# EasyEDA Pro project voice-light.eprj

# Schematic Schematic1
Board Name: Board1; Create Date: 2025-03-19; Page Name: P1; Project Name: voice-light; Schematic Name: Schematic1; Update Date: 2025-03-21; Company: 嘉立创EDA; Page Size: A4; Version: V1.0
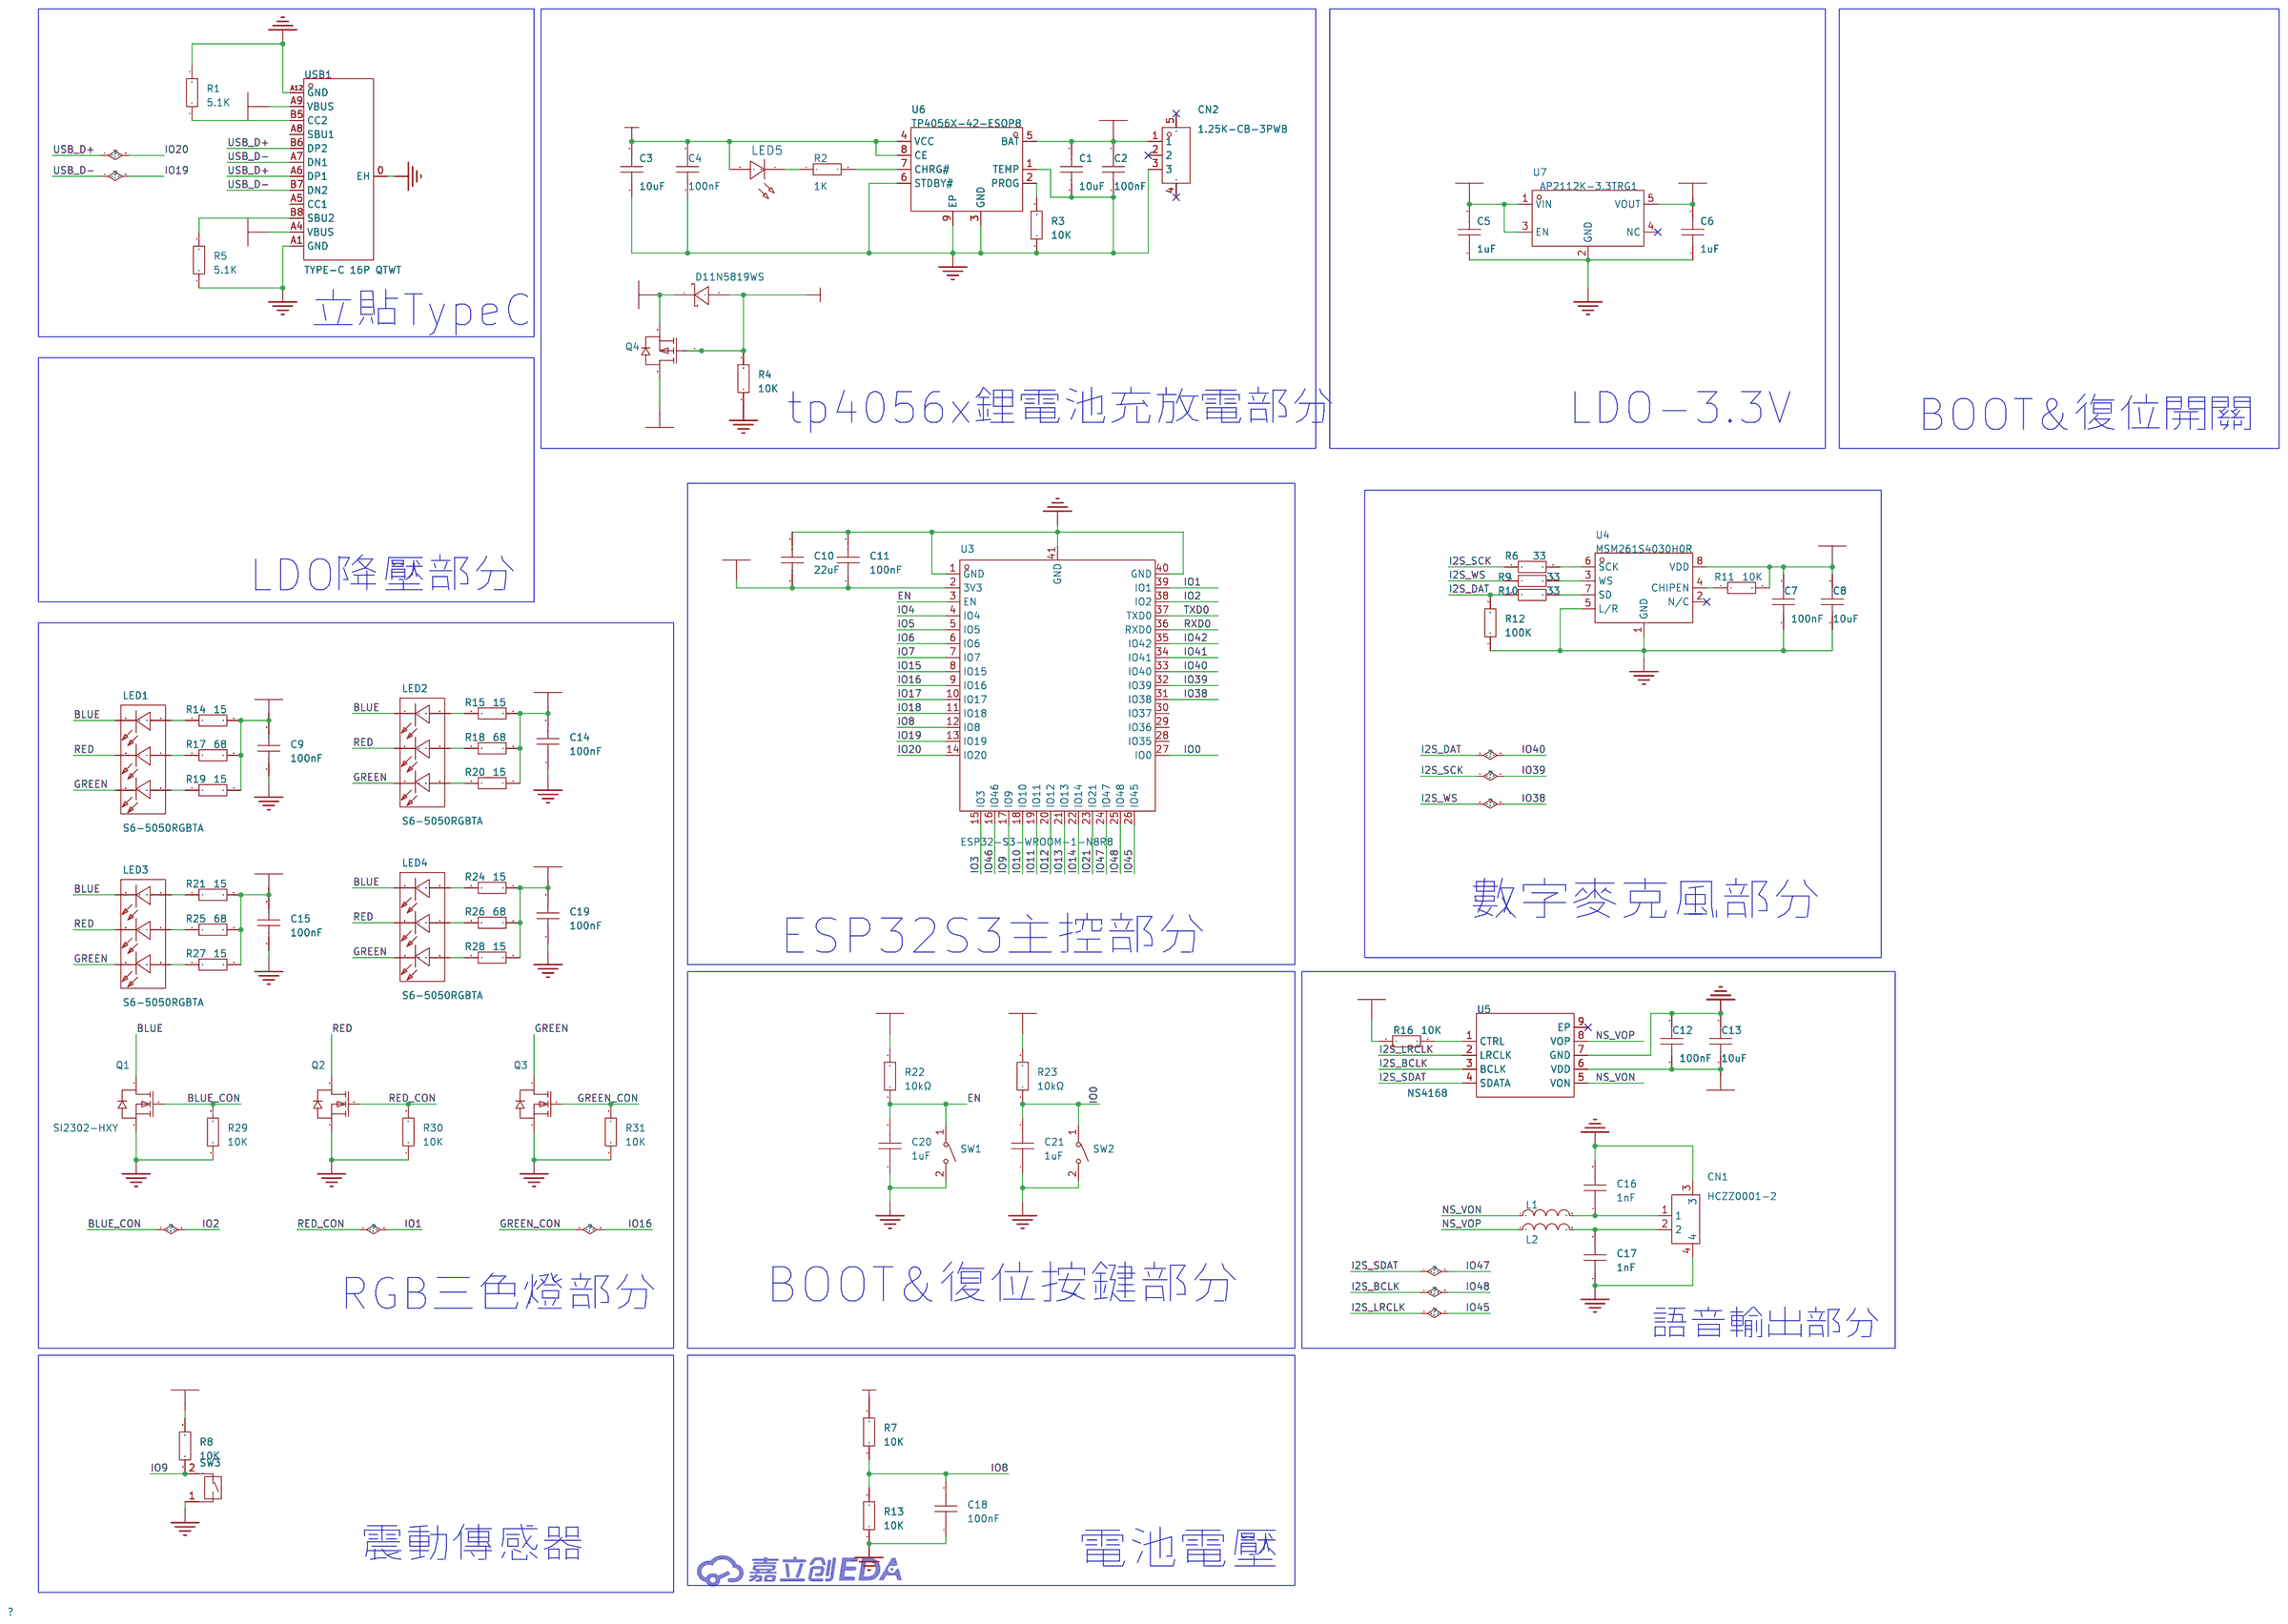
[diagram p0: schematic sheet]

## Parts
C1  10uF  [C0603]
C2  100nF  [C0603]
C3  10uF  [C0603]
C4  100nF  [C0603]
C5  1uF  [C0603]
C6  1uF  [C0603]
C7  100nF  [C0603]
C8  10uF  [C0603]
C9  100nF  [C0603]
C10  22uF  [C0603]
C11  100nF  [C0603]
C12  100nF  [C0603]
C13  10uF  [C0603]
C14  100nF  [C0603]
C15  100nF  [C0603]
C16  1nF  [C0603]
C17  1nF  [C0603]
C18  100nF  [C0603]
C19  100nF  [C0603]
C20  1uF  [C0603]
C21  1uF  [C0603]
CN1  HCZZ0001-2  [CONN-SMD_2P-P1.25_HC_HCZZ0001-2]
CN2  1.25K-CB-3PWB  [CONN-SMD_3P-P1.25_L5.5-W8.9-3PWB]
D1  1N5819WS  [SOD-323_L1.8-W1.3-LS2.5-RD]
L1  BLM18AG102SN1D  [L0603]
L2  BLM18AG102SN1D  [L0603]
LED1  S6-5050RGBTA  [LED-SMD_6P-L5.0-W5.0-P1.60-LS5.4-TL]
LED2  S6-5050RGBTA  [LED-SMD_6P-L5.0-W5.0-P1.60-LS5.4-TL]
LED3  S6-5050RGBTA  [LED-SMD_6P-L5.0-W5.0-P1.60-LS5.4-TL]
LED4  S6-5050RGBTA  [LED-SMD_6P-L5.0-W5.0-P1.60-LS5.4-TL]
LED5  -  [LED_0603]
Q1  SI2302-HXY  [SOT-23-3_L2.9-W1.3-P1.90-LS2.4-BR]
Q2  SI2302-HXY  [SOT-23-3_L2.9-W1.3-P1.90-LS2.4-BR]
Q3  SI2302-HXY  [SOT-23-3_L2.9-W1.3-P1.90-LS2.4-BR]
Q4  AO3401A  [SOT-23_L2.9-W1.3-P1.90-LS2.4-BR]
R1  5.1K  [R0603]
R2  1K  [R0603]
R3  10K  [R0603]
R4  10K  [R0603]
R5  5.1K  [R0603]
R6  33  [R0603]
R7  10K  [R0603]
R8  10K  [R0603]
R9  33  [R0603]
R10  33  [R0603]
R11  10K  [R0603]
R12  100K  [R0603]
R13  10K  [R0603]
R14  15  [R0603]
R15  15  [R0603]
R16  10K  [R0603]
R17  68  [R0603]
R18  68  [R0603]
R19  15  [R0603]
R20  15  [R0603]
R21  15  [R0603]
R22  10kΩ  [R0603]
R23  10kΩ  [R0603]
R24  15  [R0603]
R25  68  [R0603]
R26  68  [R0603]
R27  15  [R0603]
R28  15  [R0603]
R29  10K  [R0603]
R30  10K  [R0603]
R31  10K  [R0603]
SW1  TS-1088R-02026  [SW-SMD_L3.9-W3.0-P4.45]
SW2  TS-1088R-02026  [SW-SMD_L3.9-W3.0-P4.45]
SW3  SW-18010P  [SW-TH_SW-18010P]
U3  ESP32-S3-WROOM-1-N8R8  [WIRELM-SMD_ESP32-S3-WROOM-1]
U4  MSM261S4030H0R  [MIC-SMD_8P-L4.0-W3.0-P1.00-BR]
U5  NS4168  [ESOP-8_L4.9-W3.9-P1.27-LS6.0-BL-EP]
U6  TP4056X-42-ESOP8  [SOP-8_L4.9-W3.9-P1.27-LS6.0-TL-EP]
U7  AP2112K-3.3TRG1  [SOT-25-5_L2.9-W1.6-P0.95-LS2.8-BL]
USB1  TYPE-C 16P QTWT  [USB-TYPE-C-SMD_TYPE-C-16P-QTWT]

## Library data of the parts
C1 C3 C5 C6 C8 C10 C13 = CL10A226MP8NUNE: LCSC Part Name: 22uF(226) ±20% 10V; Supplier Part: C86295; Manufacturer: SAMSUNG(三星); Supplier Footprint: 0603; JLCPCB Part Class: Extended Part; Datasheet: https://atta.szlcsc.com/upload/public/pdf/source/20170325/1490427882169.pdf; Supplier: LCSC; Temperature Coefficient: X5R; Tolerance: ±20%; Voltage Rated: 10V
C2 C4 C7 C11 C12 = 0603F104Z500CT_C83060: LCSC Part Name: 100nF -20%~+80% 50V; Supplier Part: C83060; Manufacturer: Walsin(华新科); Manufacturer Part: 0603F104Z500CT; Supplier Footprint: 0603; JLCPCB Part Class: Extended Part; Datasheet: https://atta.szlcsc.com/upload/public/pdf/source/20161119/1479540179445.pdf; Supplier: LCSC; Tolerance: -20%~+80%; Voltage Rated: 50V; Temperature Coefficient: Y5V
C9 C14-C21 = CAP_0603: Supplier Footprint: 0603
CN1 = HCZZ0001-2: LCSC Part Name: 米色 1x2P 间距:1.25mm 卧贴 系列:PicoBlade(MX 1.25); Supplier Part: C7433453; Manufacturer: HC(虹成电子); Supplier Footprint: SMD,P=1.25mm,卧贴; JLCPCB Part Class: Extended Part; Datasheet: https://atta.szlcsc.com/upload/public/pdf/source/20250106/17DF0A8C5368AAD9E388E73B1BFCA0D1.pdf; Supplier: LCSC; Pins Structure: 1x2P; Pitch: 1.25mm; Mounting Type: 卧贴; Reference Series: PicoBlade(MX 1.25); Number of Pins: 2P; Number of Rows: 1; Number of PINs Per Row: 2; Current Rating: 1A; Contact Material: 铜; Contact Plating: 锡; Operating Temperature: -25℃~+70℃; Voltage Rating: 125V; Plastic Material: LCP; Color: 米色; Z-Height of the Board: 3.6mm; X-Length of Bottom Edge on Board (Spacing Line): 7.6mm; Y-Width of Bottom Edge on Board: 5.4mm
CN2 = 1.25K-CB-3PWB: LCSC Part Name: 1x3P 间距:1.25mm 卧贴; Supplier Part: C2919571; Manufacturer: HDGC(华德共创); Supplier Footprint: SMD,P=1.25mm,卧贴; JLCPCB Part Class: 扩展库; Datasheet: https://atta.szlcsc.com/upload/public/pdf/source/20211115/F776F48743F73668B48ED2809AC4027A.pdf; Supplier: LCSC; Pins Structure: 1x3P; Pitch: 1.25mm; Mounting Style: 卧贴; Number of Pins: 3P; Number of Rows: 1; Number of PINs Per Row: 3; Current Rating (Max): 1A; Operating Temperature Range: -25℃~+85℃
D1 = 1N5819WS_C191023: LCSC Part Name: 电压:40V 电流:1A; Supplier Part: C191023; Manufacturer: Hottech(合科泰); Supplier Footprint: SOD-323; JLCPCB Part Class: Basic Part; Datasheet: https://atta.szlcsc.com/upload/public/pdf/source/20220428/3CB86FD8D28D653594B4E35F9D5AEFD9.pdf; Supplier: LCSC; Forward Voltage (Vf@If): 600mV@1A; Reverse Voltage (Vr): 40V; Rectified Current: 1A
L1 L2 = BLM18AG102SN1D: LCSC Part Name: 单路 0603磁珠 阻抗1kΩ@100MHz; Supplier Part: C85824; Manufacturer: muRata(村田); Supplier Footprint: 0603; JLCPCB Part Class: 扩展库; Datasheet: https://atta.szlcsc.com/upload/public/pdf/source/20180329/C160981_FD3C2D2622A377E203B89F4AA32B0741.pdf; Supplier: LCSC; Impedance @ Frequency: 1kΩ@100MHz; Tolerance: ±25%; DC Resistance: 500mΩ; Current Rating: 450mA; Circuits: 1
LED1-LED4 = S6-5050RGBTA: LCSC Part Name: RGB三色; Supplier Part: C2827258; Manufacturer: TUOZHAN(拓展光电); Supplier Footprint: SMD5050; JLCPCB Part Class: 扩展库; Datasheet: https://atta.szlcsc.com/upload/public/pdf/source/20210520/C2827258_40E9C151CEA691D555786A4FF94C5B68.pdf; Supplier: LCSC; Viewing Angle: 120°; Lens Color: 无色透明透镜; Operating Temperature: -40℃~+85℃
LED5 = LED_0603-R: Supplier Footprint: 0603
Q1-Q3 = SI2302-HXY: LCSC Part Name: 1个N沟道 耐压:20V 电流:2.8A; Supplier Part: C4748714; Manufacturer: HXY MOSFET(华轩阳电子); Supplier Footprint: SOT-23; JLCPCB Part Class: 扩展库; Datasheet: https://atta.szlcsc.com/upload/public/pdf/source/20220720/B2EC63D46AD65363D9D3692163B46869.pdf; Supplier: LCSC; Type: 1个N沟道; Drain to Source Voltage: 20V; Current - Continuous Drain(Id): 2.8A; RDS(on): 55mΩ@4.5V,2.8A; Pd - Power Dissipation: 900mW; Gate Threshold Voltage (Vgs(th)@Id): 1.2V; Gate Charge(Qg): 5nC@4.5V; Input Capacitance(Ciss@Vds): 260pF; Reverse Transfer Capacitance (Crss@Vds): 27pF; Operating Temperature: -55℃~+150℃
Q4 = AO3401A_C15127: LCSC Part Name: 1个P沟道 耐压:30V 电流:4A; Supplier Part: C15127; Manufacturer: AOS; Supplier Footprint: SOT-23; JLCPCB Part Class: Basic Part; Datasheet: https://atta.szlcsc.com/upload/public/pdf/source/20160507/1462613609053.pdf; Supplier: LCSC; Type: 1个P沟道; Drain Source Voltage (Vdss): 30V; Continuous Drain Current (Id): 4A; Drain Source On Resistance (RDS(on)@Vgs,Id): 44mΩ@10V,4.3A; Power Dissipation (Pd): 1.4W; Gate Threshold Voltage (Vgs(th)@Id): 1.3V@250uA; Total Gate Charge (Qg@Vgs): 12.2nC@4.5V; Input Capacitance (Ciss@Vds): 1.2nF@15V; Operating Temperature: -55℃~+150℃@(Tj)
R1-R21 R24-R31 = Res_0603: Supplier Footprint: 0603
R22 R23 = CR0603JA0103G: LCSC Part Name: 10kΩ ±5% 1/10W; Supplier Part: C101254; Manufacturer: LIZ(丽智电子); Supplier Footprint: 0603; JLCPCB Part Class: Extended Part; Datasheet: https://atta.szlcsc.com/upload/public/pdf/source/20170408/1491631441449.pdf; Supplier: LCSC; Type: 厚膜电阻; Tolerance: ±5%; Power(Watts): 1/10W; Temperature Coefficient: ±200ppm/℃; Overload Voltage (Max): 50V; Operating Temperature Range: -55℃~+125℃
SW1 SW2 = TS-1088R-02026: LCSC Part Name: 贴片无柱小龟轻触开关 260GF; Supplier Part: C455280; Manufacturer: XUNPU(讯普); Supplier Footprint: SMD,3x4x2mm; JLCPCB Part Class: Extended Part; Datasheet: https://atta.szlcsc.com/upload/public/pdf/source/20191118/C455280_718CC4284DAF75EEB0AC8229AE7E40C5.pdf; Supplier: LCSC; Contact Current: 50mA; Voltage Rating (DC): 12V; Circuit: 单刀单掷; Mounting Style: 立贴; Actuator Style: 圆形按钮; Switch Length: 3.9mm; Switch Width: 2.93mm; Switch Height: 2mm
SW3 = SW-18010P: LCSC Part Name: 高灵敏震动开关SW-18010P 玩具限位弹簧开关抖动振动开关 黑色直脚; Supplier Part: C2681585; Manufacturer: SHOU HAN(首韩); Supplier Footprint: 插件; JLCPCB Part Class: 扩展库; Datasheet: https://atta.szlcsc.com/upload/public/pdf/source/20250219/9523837BE0E6F605E61503F118837C52.pdf; Supplier: LCSC; Voltage Rating: 12V; Current Rating: 20mA; Life: 100万次
U3 = ESP32-S3-WROOM-1-N8R8: Supplier Part: C2913201; Manufacturer: ESPRESSIF(乐鑫); Supplier Footprint: SMD,25.5x18mm; JLCPCB Part Class: 扩展库; Datasheet: https://atta.szlcsc.com/upload/public/pdf/source/20241030/6A412B13087E1327DF6279F5735253CA.pdf; Supplier: LCSC
U4 = MSM261S4030H0R: Supplier Part: C2840615; Manufacturer: MEMS(敏芯微); JLCPCB Part Class: Extended Part; Datasheet: https://atta.szlcsc.com/upload/public/pdf/source/20210707/C2840615_6AE5BCBEE3224C96A8195D5DC270E7C8.pdf; Supplier: LCSC
U5 = NS4168_C910588: Supplier Part: C910588; Manufacturer: Nsiway(纳芯威); Supplier Footprint: ESOP-8-EP(3.9x4.9x1.27); JLCPCB Part Class: Extended Part; Datasheet: https://atta.szlcsc.com/upload/public/pdf/source/20240722/6A2F478F91F6E02E759B805C93276334.pdf; Supplier: LCSC; Class: D类功放; Output Power: 2.5Wx1@4Ω; Voltage - Supply: 3V~5.5V
U6 = TP4056X-42-ESOP8: Supplier Part: C2763448; Manufacturer: TOPPOWER(南京拓微); Supplier Footprint: SOP-8-EP; JLCPCB Part Class: Extended Part; Datasheet: https://atta.szlcsc.com/upload/public/pdf/source/20221111/3D7D53D5011BF4ED4C4D0D9BFDBB1404.pdf; Supplier: LCSC
U7 = AP2112K-3.3TRG1: 输出类型:固定;最大输入电压:6V;输出电压:3.3V;输出电流:600mA;电源纹波抑制比(PSRR):65dB@(1kHz);输出极性:正极;; LCSC Part Name: 输入6V 输出3.3V 600mA; Supplier Part: C51118; Manufacturer: DIODES(美台); Supplier Footprint: SOT-25-5; JLCPCB Part Class: Extended Part; Datasheet: https://atta.szlcsc.com/upload/public/pdf/source/20171221/C51118_15138312998391195590.pdf; Supplier: LCSC; Output Type: 固定; Maximum Input Voltage: 6V; Output Voltage: 3.3V; Output Current: 600mA; Power Supply Rejection Ratio (PSRR): 65dB@(1kHz); Dropout Voltage: 400mV@(600mA); standby current: 80uA; Feature: 防静电保护；自动放电功能；低ESR；热保护(TSD)；过流保护(OCP)；带使能; Operating Temperature: -40℃~+85℃; Output Polarity: 正极; Number of Outputs: 1
USB1 = TYPE-C 16P QTWT: LCSC Part Name: Type-C 母 卧贴; Supplier Part: C5187472; Manufacturer: SHOU HAN(首韩); Supplier Footprint: SMD; JLCPCB Part Class: 扩展库; Datasheet: https://atta.szlcsc.com/upload/public/pdf/source/20220929/9CA39B32C19F2C1116A695DA9353B6B2.pdf; Supplier: LCSC; Connector Type: Type-C; Standard: USB 3.1; Gender: 母; Mounting Style: 卧贴; Number of Contacts: 16P; Number of Ports: 1; Current Rating - Power (Max): 3A; Operating Temperature Range: -25℃~+85℃; Rated Voltage (Max): 5V; Connect-Disconnect Life: 1万次; Core Colour: 黑色

## Nets
+3.3V: C6.2 C7.2 C8.2 C9.2 C10.1 C11.1 C14.2 C15.2 C19.2 R8.2 R11.2 R14.2 R15.2 R17.2 R18.2 R19.2 R20.2 R21.2 R22.2 R23.2 R24.2 R25.2 R26.2 R27.2 R28.2 U3.2(3V3) U4.8(VDD) U7.5(VOUT)
+5V: C5.2 C12.1 C13.1 D1.1(K) Q4.2(S) R16.1 U5.6(VDD) U7.1(VIN) U7.3(EN)
GND: C1.1 C2.1 C3.1 C4.1 C5.1 C6.1 C7.1 C8.1 C9.1 C10.2 C11.2 C12.2 C13.2 C14.1 C15.1 C16.2 C17.1 C18.1 C19.1 C20.1 C21.1 CN1.3 CN1.4 CN2.3 Q1.2(S) Q2.2(S) Q3.2(S) R1.2 R3.1 R4.1 R5.1 R12.1 R13.1 R29.1 R30.1 R31.1 SW1.2 SW2.2 SW3.1 U3.1(GND) U3.40(GND) U3.41(GND) U4.1(GND) U4.5(L/R) U5.7(GND) U6.1(TEMP) U6.3(GND) U6.6(STDBY#) U6.9(EP) U7.2(GND) USB1.0(EH) USB1.A1(GND) USB1.A12(GND)
VBAT: C1.2 C2.2 CN2.1 Q4.3(D) R7.2 U6.5(BAT)
VIN: C3.2 C4.2 D1.2(A) LED5.2(A) Q4.1(G) R4.2 U6.4(VCC) U6.8(CE) USB1.A4(VBUS) USB1.A9(VBUS)
BLUE: LED1.1 LED2.1 LED3.1 LED4.1 Q1.3(D)
BLUE_CON: Q1.1(G) R29.2 U3.38(IO2)
EN: C20.2 R22.1 SW1.1 U3.3(EN)
GREEN: LED1.5 LED2.5 LED3.5 LED4.5 Q3.3(D)
GREEN_CON: Q3.1(G) R31.2 U3.9(IO16)
I2S_BCLK: U3.25(IO48) U5.3(BCLK)
I2S_DAT: R10.1 R12.2 U3.33(IO40)
I2S_LRCLK: U3.26(IO45) U5.2(LRCLK)
I2S_SCK: R6.1 U3.32(IO39)
I2S_SDAT: U3.24(IO47) U5.4(SDATA)
I2S_WS: R9.1 U3.31(IO38)
IO0: C21.2 R23.1 SW2.1 U3.27(IO0)
IO1: Q2.1(G) R30.2 U3.39(IO1)
IO3: U3.15(IO3)
IO4: U3.4(IO4)
IO5: U3.5(IO5)
IO6: U3.6(IO6)
IO7: U3.7(IO7)
IO8: C18.2 R7.1 R13.2 U3.12(IO8)
IO9: R8.1 SW3.2 U3.17(IO9)
IO10: U3.18(IO10)
IO11: U3.19(IO11)
IO12: U3.20(IO12)
IO13: U3.21(IO13)
IO14: U3.22(IO14)
IO15: U3.8(IO15)
IO17: U3.10(IO17)
IO18: U3.11(IO18)
IO19: U3.13(IO19) USB1.A7(DN1) USB1.B7(DN2)
IO20: U3.14(IO20) USB1.A6(DP1) USB1.B6(DP2)
IO21: U3.23(IO21)
IO41: U3.34(IO41)
IO42: U3.35(IO42)
IO46: U3.16(IO46)
NS_VON: L1.1 U5.5(VON)
NS_VOP: L2.1 U5.8(VOP)
RED: LED1.3 LED2.3 LED3.3 LED4.3 Q2.3(D)
RXD0: U3.36(RXD0)
TXD0: U3.37(TXD0)
$1N2976: R1.1 USB1.B5(CC2)
$1N3072: R5.2 USB1.B8(SBU2)
$1N13153: R11.1 U4.4(CHIPEN)
$1N13381: R10.2 U4.7(SD)
$1N13399: R6.2 U4.6(SCK)
$1N13403: R9.2 U4.3(WS)
$1N17103: R16.2 U5.1(CTRL)
$1N23304: LED5.1(C) R2.1
$1N23309: R2.2 U6.7(CHRG#)
$1N23525: R3.2 U6.2(PROG)
$1N31483: C17.2 CN1.2 L2.2
$1N31497: C16.1 CN1.1 L1.2
$1N33475: LED1.2 R14.1
$1N33478: LED1.6 R19.1
$1N33481: LED1.4 R17.1
$1N33489: LED3.2 R21.1
$1N33492: LED3.6 R27.1
$1N33495: LED3.4 R25.1
$1N33498: LED4.6 R28.1
$1N33506: LED4.2 R24.1
$1N33509: LED4.4 R26.1
$1N33512: LED2.6 R20.1
$1N33520: LED2.2 R15.1
$1N33523: LED2.4 R18.1

Not connected (* = marked no-connect by the designer): CN2 2* 4* 5*; U3 28(IO35) 29(IO36) 30(IO37); U4 2(N/C)*; U5 9(EP)*; U7 4(NC)*; USB1 A5(CC1) A8(SBU1)

## Notes on the sheet
- 立貼TypeC
- tp4056x鋰電池充放電部分
- LDO-3.3V
- BOOT&復位開關
- LDO降壓部分
- 數字麥克風部分
- ESP32S3主控部分
- RGB三色燈部分
- BOOT&復位按鍵部分
- 語音輸出部分
- 震動傳感器
- 電池電壓

# Board PCB1
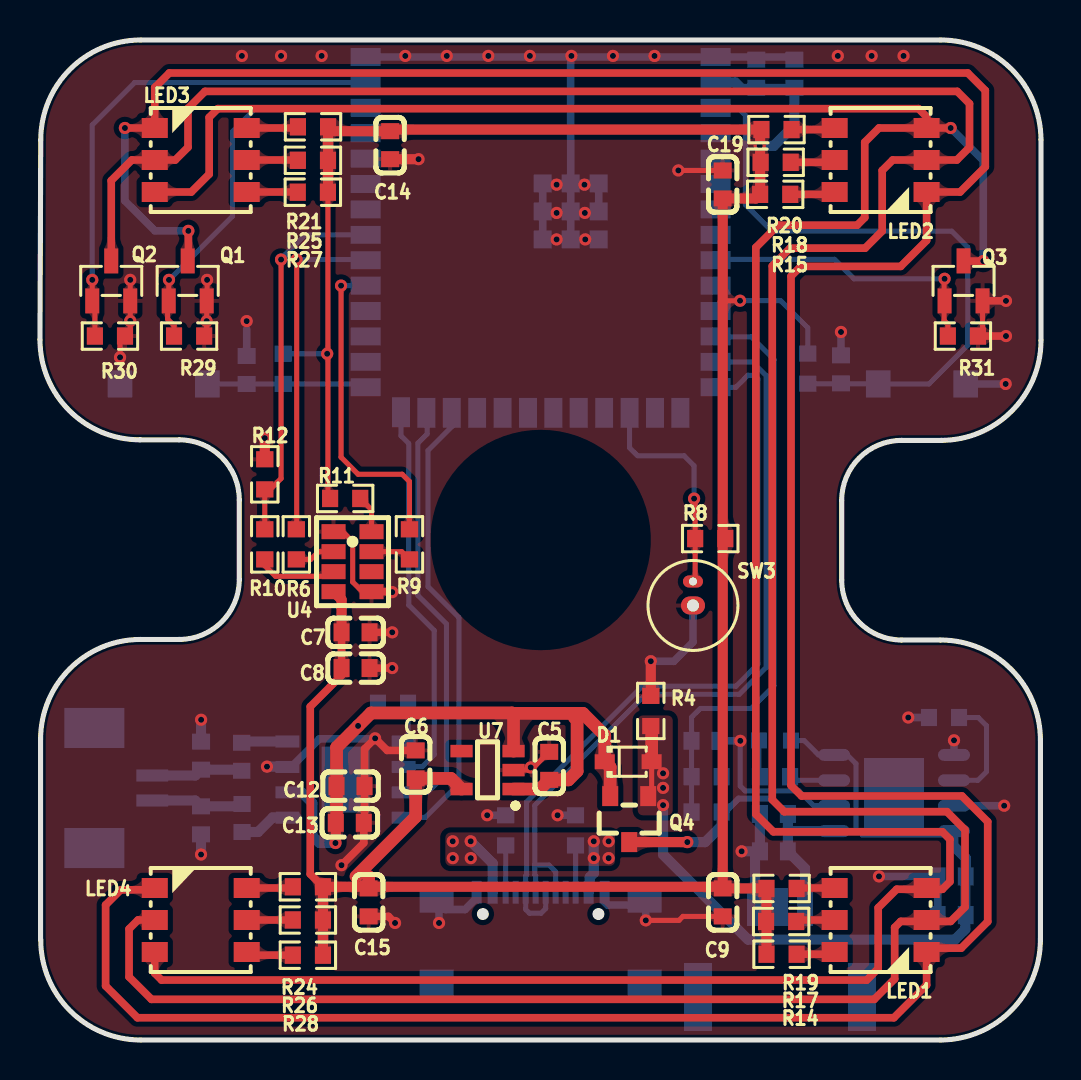
[diagram p1: board, top side]
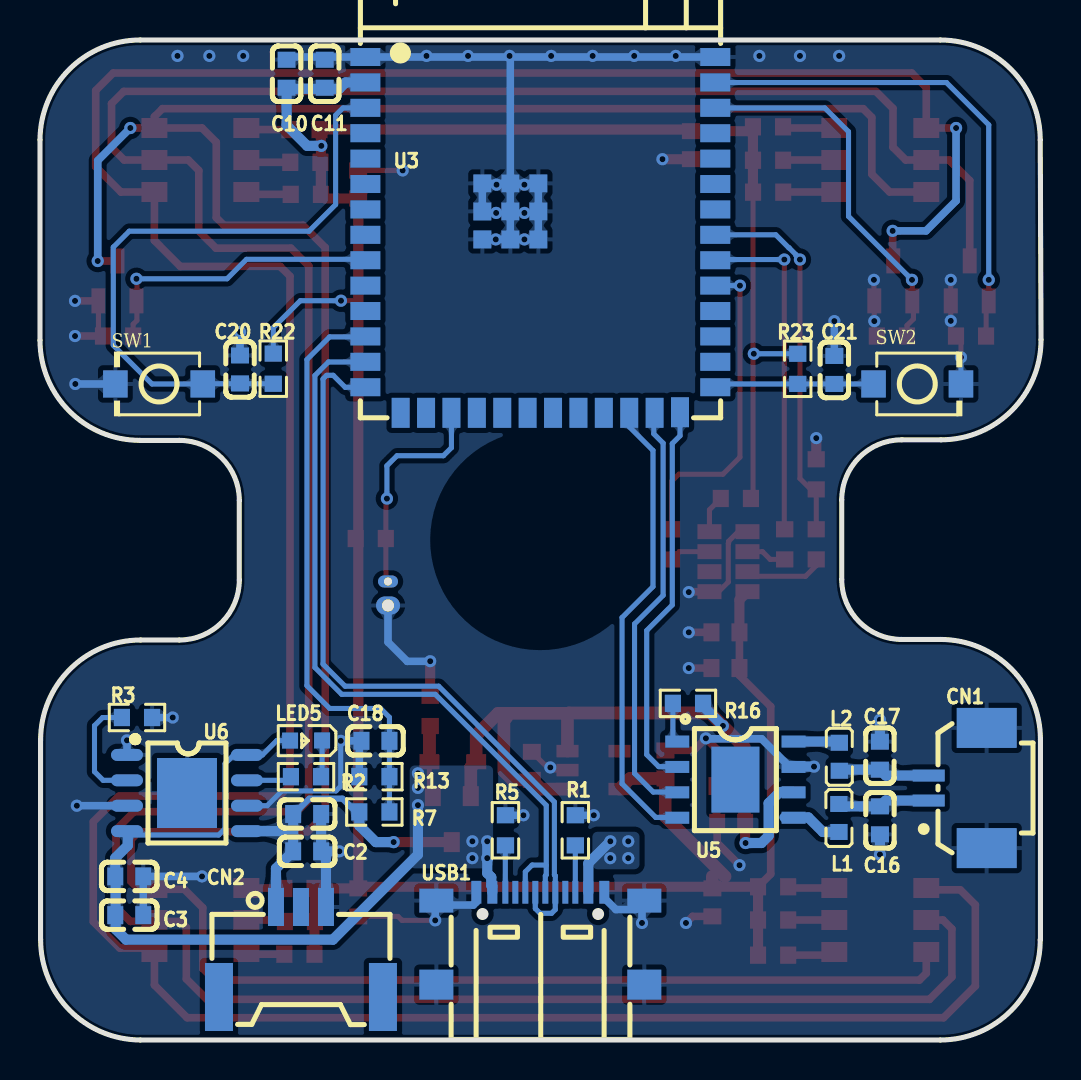
[diagram p2: board, bottom side, seen from below]

Outline 50.06 x 50 mm; copper layers: Top Layer, Bottom Layer. Coordinates in mm from the lower left corner of the outline.
Outline path: 0,35.01 0.04,45 arc(1.5,48.54) 5.04,50 45.04,50 arc(48.58,48.54) 50.06,45.01 50.06,34.98 arc(48.59,31.45) 45.06,29.98 43.09,29.98 arc(40.97,29.1) 40.09,26.98 40.09,23 arc(40.97,20.88) 43.09,20 45.03,20 arc(48.57,18.54) 50.03,15 50.03,5.03 arc(48.57,1.48) 45.04,0 5.04,0 arc(1.5,1.46) 0.04,5 0.03,5.06 0.03,15.03 arc(1.49,18.56) 5.03,20.03 6.97,20.03 arc(9.09,20.91) 9.97,23.03 9.97,27.01 arc(9.09,29.13) 6.97,30.01 5,30.01 arc(1.46,31.47) 0,35.01
Stack: Top Layer 0.035mm / Dielectric1 1.51mm FR4 er 4.5 / Bottom Layer 0.035mm

## Design rules (mm)
net IO19: IO1920
net IO20: IO1920
template: JLCPCB Capability(Two Layers Board)
spacing copperThickness1oz (default): track to track 0.102, other pairs 0.152 to 0.3
spacing copperThickness2oz: track to track 0.203, other pairs 0.152 to 0.3
track width copperThickness1oz (default): min 0.127, default 0.254, max 2.54
track width copperThickness2oz: min 0.203, default 0.254, max 2.54
differential pair differentialPair (default): width min 0.127, default 0.254, max 2.54; gap min 0.152, default 0.152
via viaSize (default): diameter min 0.5, default 0.61, max 10; hole min 0.3, default 0.305, max 6.3

## Placement (name value [footprint] x y rotation side)
C1  10uF  [C0603]  36.7 11.3 0 bottom
C2  100nF  [C0603]  36.7 9.43 0 bottom
C3  10uF  [C0603]  45.6 6.24 0 bottom
C4  100nF  [C0603]  45.6 8.18 0 bottom
C5  1uF  [C0603]  25.46 13.71 270 top
C6  1uF  [C0603]  18.79 13.78 270 top
C7  100nF  [C0603]  15.78 20.38 180 top
C8  10uF  [C0603]  15.78 18.6 180 top
C9  100nF  [C0603]  34.14 6.88 90 top
C10  22uF  [C0603]  37.73 48.31 90 bottom
C11  100nF  [C0603]  35.82 48.31 90 bottom
C12  100nF  [C0603]  15.53 12.7 0 top
C13  10uF  [C0603]  15.49 10.86 0 top
C14  100nF  [C0603]  17.51 44.74 90 top
C15  100nF  [C0603]  16.44 6.88 90 top
C16  1nF  [C0603]  8.05 10.98 270 bottom
C17  1nF  [C0603]  8.06 14.22 270 bottom
C18  100nF  [C0603]  33.28 14.96 180 bottom
C19  100nF  [C0603]  34.14 42.78 270 top
C20  1uF  [C0603]  40.06 33.53 270 bottom
C21  1uF  [C0603]  10.34 33.5 270 bottom
CN1  HCZZ0001-2  [CONN-SMD_2P-P1.25_HC_HCZZ0001-2]  4.17 12.6 90 bottom
CN2  1.25K-CB-3PWB  [CONN-SMD_3P-P1.25_L5.5-W8.9-3PWB]  37.01 4.4 180 bottom
D1  1N5819WS  [SOD-323_L1.8-W1.3-LS2.5-RD]  29.41 13.91 0 top
L1  BLM18AG102SN1D  [L0603]  10.11 11.1 90 bottom
L2  BLM18AG102SN1D  [L0603]  10.09 14.16 270 bottom
LED1  S6-5050RGBTA  [LED-SMD_6P-L5.0-W5.0-P1.60-LS5.4-TL]  42.04 6 180 top
LED2  S6-5050RGBTA  [LED-SMD_6P-L5.0-W5.0-P1.60-LS5.4-TL]  42.04 44 180 top
LED3  S6-5050RGBTA  [LED-SMD_6P-L5.0-W5.0-P1.60-LS5.4-TL]  8.04 44 0 top
LED4  S6-5050RGBTA  [LED-SMD_6P-L5.0-W5.0-P1.60-LS5.4-TL]  8.04 6 0 top
LED5  -  [LED_0603]  36.8 14.97 0 bottom
Q1  SI2302-HXY  [SOT-23-3_L2.9-W1.3-P1.90-LS2.4-BR]  7.39 37.96 270 top
Q2  SI2302-HXY  [SOT-23-3_L2.9-W1.3-P1.90-LS2.4-BR]  3.56 37.96 270 top
Q3  SI2302-HXY  [SOT-23-3_L2.9-W1.3-P1.90-LS2.4-BR]  46.19 37.96 270 top
Q4  AO3401A  [SOT-23_L2.9-W1.3-P1.90-LS2.4-BR]  29.47 11.05 90 top
R1  5.1K  [R0603]  23.29 10.48 90 bottom
R2  1K  [R0603]  36.76 13.17 0 bottom
R3  10K  [R0603]  45.21 16.12 0 bottom
R4  10K  [R0603]  30.55 16.45 270 top
R5  5.1K  [R0603]  26.78 10.48 270 bottom
R6  33  [R0603]  12.82 24.78 270 top
R7  10K  [R0603]  33.34 11.4 0 bottom
R8  10K  [R0603]  33.52 25.07 0 top
R9  33  [R0603]  18.48 24.78 270 top
R10  33  [R0603]  11.24 24.78 270 top
R11  10K  [R0603]  15.26 27.08 180 top
R12  100K  [R0603]  11.24 28.28 270 top
R13  10K  [R0603]  33.34 13.17 180 bottom
R14  15  [R0603]  37.09 4.29 180 top
R15  15  [R0603]  36.77 42.28 180 top
R16  10K  [R0603]  17.66 16.83 0 bottom
R17  68  [R0603]  37.06 5.93 180 top
R18  68  [R0603]  36.79 43.89 180 top
R19  15  [R0603]  37.09 7.58 180 top
R20  15  [R0603]  36.83 45.52 180 top
R21  15  [R0603]  13.65 45.66 0 top
R22  10kΩ  [R0603]  38.39 33.57 90 bottom
R23  10kΩ  [R0603]  12.17 33.56 90 bottom
R24  15  [R0603]  13.4 7.66 0 top
R25  68  [R0603]  13.65 43.99 0 top
R26  68  [R0603]  13.4 6 0 top
R27  15  [R0603]  13.65 42.39 0 top
R28  15  [R0603]  13.4 4.24 0 top
R29  10K  [R0603]  7.46 35.2 180 top
R30  10K  [R0603]  3.5 35.2 180 top
R31  10K  [R0603]  46.15 35.2 180 top
SW1  TS-1088R-02026  [SW-SMD_L3.9-W3.0-P4.45]  44.1 32.8 0 bottom
SW2  TS-1088R-02026  [SW-SMD_L3.9-W3.0-P4.45]  6.19 32.8 180 bottom
SW3  SW-18010P  [SW-TH_SW-18010P]  32.66 22.33 270 top
U3  ESP32-S3-WROOM-1-N8R8  [WIRELM-SMD_ESP32-S3-WROOM-1]  25.04 40.25 180 bottom
U4  MSM261S4030H0R  [MIC-SMD_8P-L4.0-W3.0-P1.00-BR]  15.63 23.92 0 top
U5  NS4168  [ESOP-8_L4.9-W3.9-P1.27-LS6.0-BL-EP]  15.28 13.02 270 bottom
U6  TP4056X-42-ESOP8  [SOP-8_L4.9-W3.9-P1.27-LS6.0-TL-EP]  42.71 12.35 180 bottom
U7  AP2112K-3.3TRG1  [SOT-25-5_L2.9-W1.6-P0.95-LS2.8-BL]  22.38 13.5 90 top
USB1  TYPE-C 16P QTWT  [USB-TYPE-C-SMD_TYPE-C-16P-QTWT]  25.04 5.08 180 bottom

## Footprints (pads in the part's own frame, mm; a bottom-side part is the same pattern mirrored in y, then rotated)
C0603
  rect 0.8x0.9 smd: 1(-0.7,0) 2(0.7,0)
CONN-SMD_2P-P1.25_HC_HCZZ0001-2
  rect 0.6x1.6 smd: 1(-0.625,1.45) 2(0.625,1.45)
  rect 2x3 smd: 3(-3.005,-1.45) 4(3.005,-1.45)
CONN-SMD_3P-P1.25_L5.5-W8.9-3PWB
  rect 0.8x1.9 smd: 1(-1.25,2.25) 2(0,2.25) 3(1.25,2.25)
  rect 1.4x3.4 smd: 4(4.1,-2.25) 5(-4.1,-2.25)
ESOP-8_L4.9-W3.9-P1.27-LS6.0-BL-EP
  rect 0.6x1.2 smd: 1(-1.905,-2.909) 2(-0.635,-2.909) 3(0.635,-2.909) 4(1.905,-2.909) 5(1.905,2.909) 6(0.635,2.909) 7(-0.635,2.909) 8(-1.905,2.909)
  rect 3.3x2.4 smd: 9(0,0)
L0603
  rect 0.8x0.864 smd: 1(-0.7,0) 2(0.7,0)
LED-SMD_6P-L5.0-W5.0-P1.60-LS5.4-TL
  rect 1.3x1 smd: 1(-2.3,1.6) 2(2.3,1.6) 3(-2.3,0) 4(2.3,0) 5(-2.3,-1.6) 6(2.3,-1.6)
LED_0603
  rect 0.8x0.8 smd: 1(-0.851,-0.01) 2(0.75,-0.005)
MIC-SMD_8P-L4.0-W3.0-P1.00-BR
  rect 1.2x0.75 smd: 1(0.95,-1.5) 2(0.95,-0.5) 3(0.95,0.5) 4(0.95,1.5) 5(-0.95,1.5) 6(-0.95,0.5) 7(-0.95,-0.5) 8(-0.95,-1.5)
R0603
  rect 0.806x0.864 smd: 1(-0.753,0) 2(0.753,0)
SOD-323_L1.8-W1.3-LS2.5-RD
  rect 1x0.75 smd: 1(-1.173,0) 2(1.173,0)
SOP-8_L4.9-W3.9-P1.27-LS6.0-TL-EP
  oval 1.6x0.6 smd: 1(-3,1.905) 2(-3,0.635) 3(-3,-0.635) 4(-3,-1.905) 5(3,-1.905) 6(3,-0.635) 7(3,0.635) 8(3,1.905)
  rect 3x3.5 smd: 9(0,0)
SOT-23-3_L2.9-W1.3-P1.90-LS2.4-BR
  rect 1.25x0.7 smd: 1(1,-0.95) 2(1,0.95) 3(-1,0)
SOT-23_L2.9-W1.3-P1.90-LS2.4-BR
  rect 1x0.8 smd: 1(1.15,-0.95) 2(1.15,0.95) 3(-1.15,0)
SOT-25-5_L2.9-W1.6-P0.95-LS2.8-BL
  rect 0.623x1.105 smd: 1(-0.95,-1.3) 2(-0.001,-1.3) 3(0.95,-1.3) 4(0.95,1.3) 5(-0.95,1.3)
SW-SMD_L3.9-W3.0-P4.45
  rect 1.23x1.36 smd: 1(-2.185,0) 2(2.185,0)
SW-TH_SW-18010P
  oval 0.9x1.2 hole 0.6: 1(0.6,0)
  oval 0.6x1 hole 0.4: 2(-0.6,0)
USB-TYPE-C-SMD_TYPE-C-16P-QTWT
  rect 1.7x1.5 smd: 0(-5.2,-2.309) 0(5.2,-2.309)
  rect 1.7x1.2 smd: 0(-5.2,1.891) 0(5.2,1.891)
  rect 0.5x1.14 smd: A1(-3.2,2.308) A4(-2.4,2.308) A9(2.4,2.308) A12(3.2,2.308)
  rect 0.3x1.14 smd: A5(-1.25,2.308) A6(-0.25,2.308) A7(0.25,2.308) A8(1.25,2.309) B5(1.75,2.308) B6(0.75,2.308) B7(-0.75,2.308) B8(-1.75,2.309)
WIRELM-SMD_ESP32-S3-WROOM-1
  rect 1.5x0.9 smd: 1(-8.75,8.895) 2(-8.75,7.625) 3(-8.75,6.355) 4(-8.75,5.085) 5(-8.75,3.815) 6(-8.75,2.545) 7(-8.75,1.275) 8(-8.75,0.005) 9(-8.75,-1.265) 10(-8.75,-2.535) 11(-8.75,-3.805) 12(-8.75,-5.075) 13(-8.75,-6.345) 14(-8.75,-7.615) 27(8.75,-7.615) 28(8.75,-6.345) 29(8.75,-5.075) 30(8.75,-3.805) 31(8.75,-2.535) 32(8.75,-1.265) 33(8.75,0.005) 34(8.75,1.275) 35(8.75,2.545) 36(8.75,3.815) 37(8.75,5.085) 38(8.75,6.355) 39(8.75,7.625) 40(8.75,8.895)
  rect 0.9x1.5 smd: 15(-6.985,-8.895) 16(-5.715,-8.895) 17(-4.445,-8.895) 18(-3.175,-8.895) 19(-1.905,-8.895) 20(-0.635,-8.895) 21(0.635,-8.895) 22(1.905,-8.895) 23(3.175,-8.895) 24(4.445,-8.895) 25(5.715,-8.895) 26(6.985,-8.865)
  rect 0.9x0.9 smd: 41(-2.9,-0.225) 41(-2.9,1.175) 41(-2.9,2.575) 41(-1.5,-0.225) 41(-1.5,1.175) 41(-1.5,2.575) 41(-0.1,-0.225) 41(-0.1,1.175) 41(-0.1,2.575)

## Nets
As in the schematic.

Pads without a net: CN2 2 4 5; U3 28 29 30; U4 2; U5 9; U7 4; USB1 A5 A8

## Via types
v1: diameter 0.61, hole 0.305, Top Layer to Bottom Layer, 81 vias

## Routing (per net, layer and track width the routed paths; a pad name or vN(x,y) marks a point on that pad's centre or on a via; arc(x,y) is an arc through that point)
+3.3V: length 150
  Top Layer w0.254: R27.2 14.4,27.19 R11.2 ; 34.14,36.91 34.19,36.96 v1(35.01,36.96)
  Top Layer w0.381: C7.2 C8.2 15.08,18.23 13.52,16.67 13.52,8.3 R24.2
  Top Layer w0.508: 33.92,7.66 R24.2 R26.2 R28.2 ; U4.8 15.08,22.02 C7.2 ; R27.2 14.41,42.4 R21.2 14.62,45.44 C14.2 17.59,45.52 R20.2 36.01,45.46 R15.2 35.81,42.08 C19.2 34.14,7.88 ; R14.2 R19.2 36.33,7.58 C9.2
  Top Layer w0.635: 21.08,12.55 20.55,13.08 C6.2 18.79,11.17 15.8,8.18 ; 16.44,8.18 C15.2
  Bottom Layer w0.254: R22.2 38.39,35.61 37.04,36.96 v1(35.01,36.96) ; R23.2 v1(14.36,34.31)
  Bottom Layer w0.508: U3.2 34.77,47.88 35.09,47.56 37.67,47.56 C10.1 37.73,45.74 36.7,44.71 v1(35.99,44.71)
+5V: length 36.7
  Top Layer w0.508: C13.1 14.79,9.87 v1(14.78,9.85)
  Top Layer w0.635: 26.73,16.12 26.86,15.98 26.86,13.44 26.43,13.01 25.46,13.01 25,12.55 U7.1 ; 23.63,16.33 27.15,16.33 28.24,15.24 D1.1 28.52,13.64 Q4.2 ; 23.63,16.33 23.68,16.28 U7.3 ; 23.63,16.33 23.61,16.35 16.56,16.35 14.83,14.63 C12.1 14.83,10.9 C13.1
  Bottom Layer w0.508: v1(14.78,9.85) 13.98,9.85 13.62,10.21 13.62,11.84 13.06,12.4 12.37,12.4 ; R16.1 16.9,16.7 v1(15.91,15.71)
GND: length 134.9
  Top Layer w0.254: v1(30.3,5.98) 31.96,5.98 32.16,6.18 C9.1 ; R31.1 47.14,35.43 Q3.2 ; U7.2 24.41,13.5 v1(24.54,13.63) 24.69,13.63 C5.1 ; U4.5 15.14,25.42 15.62,24.93 15.62,24.85 15.64,24.84 15.64,22.9 16.17,22.36 16.53,22.36 U4.1 ; v1(8.36,38.01) 8.36,36.97 Q1.2 v1(8.34,35.94) 8.34,35.33 R29.1 ; v1(4,34.13) 4,34.95 4.25,35.2 4.51,35.46 v1(4.51,35.96) Q2.2 4.51,37.97 ; C19.1 v1(31.92,43.48)
  Top Layer w0.381: R31.1 v1(48.31,35.2) ; C6.1 17.36,14.48 v1(16.76,15.08) 16.23,14.56 C12.2 16.23,10.9 C13.2 16.19,9.86 v1(15.08,8.74) ; Q3.2 v1(48.31,36.96) ; C7.1 v1(17.62,20.38) ; C15.1 17.43,6.18 v1(17.76,5.85) ; U4.1 17.37,22.42 17.39,22.39 ; C8.1 17.45,18.6
  Top Layer w0.508: R4.1 v1(30.55,18.94) ; R12.1 v1(11.24,30.09) ; C14.1 v1(18.93,44.04)
  Bottom Layer w0.254: SW2.2 v1(4,34.13) ; 35.02,14.96 35.02,12.69 35.26,12.45 37.96,12.45 38.7,11.71 U6.6
  Bottom Layer w0.381: U3.41 27.94,42.83 26.54,42.83 ; USB1.A1 28.24,6.9 28.39,6.75 30.02,6.75 USB1.0 30.3,6.91 v1(30.3,5.98) ; 26.54,40.03 v1(25.84,40.03) 25.14,40.03 U3.41 25.14,42.83 26.54,42.83 ; 26.54,40.03 U3.41 26.54,42.83 ; 26.54,40.03 v1(27.27,40.03) 27.94,40.03 ; U6.3 v1(48.22,11.71) ; SW1.2 v1(48.29,32.8) ; R1.2 v1(22.36,11.24) ; 26.54,42.83 26.54,49.15 ; C21.1 10.34,35.54 ; 26.54,49.15 U3.1 37.59,49.15 C10.2 ; 26.54,49.15 26.54,49.17 v1(26.58,49.2) ; 26.54,49.15 U3.40 ; 12.49,13.67 12.58,13.67 13.97,15.06 16.73,15.06 v1(16.76,15.08) ; USB1.A12 21.84,7.1 21.26,6.52 20.28,6.52 19.96,6.85 ; R13.1 34.09,14.85 C18.1 v1(35.02,14.96) ; C20.1 v1(40.06,35.4) ; R5.1 v1(25.88,11.24) ; R3.1 v1(43.42,16.12) ; C3.1 C4.1 v1(41.96,8.18) ; 19.96,6.85 USB1.0 ; 19.96,6.85 19.96,5.83 ; SW3.1 32.66,19.89 31.7,18.93 30.55,18.93 v1(30.55,18.94) ; U6.1 v1(45.71,14.98)
  Bottom Layer w0.508: C2.1 C1.1 ; C2.1 v1(35.09,9.43) ; C2.1 35.76,9.19 CN2.3 ; C17.1 v1(8.06,16.01) ; 11.32,13.67 12.45,13.67 ; C16.2 v1(8.05,9.28)
  vias: v1(4.51,38.01) v1(10.1,49.2) v1(10.34,35.94) v1(11.35,13.67) v1(12.06,49.2) v1(14.08,49.2) v1(17.62,22.39) v1(17.62,18.6) v1(18.27,49.2) v1(19.96,5.85) v1(20.34,49.2) v1(22.42,49.2) v1(24.5,49.2) v1(25.84,42.77) v1(25.84,41.35) v1(27.23,42.77) v1(27.25,41.35) v1(28.65,49.2) v1(30.73,49.2) v1(39.9,49.2) v1(41.59,49.2) v1(43.19,49.2)
VBAT: length 16.9
  Top Layer w0.508: Q4.3 v1(32.37,9.9)
  Bottom Layer w0.305: R7.2 34.13,11.44 34.31,11.44 34.93,12.07 36.59,12.07 37.32,11.34 37.36,11.34 C1.2
  Bottom Layer w0.508: 37.4,10.48 C2.2 38.26,8.58 CN2.1 ; 37.4,10.48 37.43,10.44 U6.5 ; 37.4,10.48 C1.2 ; R7.2 34.09,10.72 33.27,9.9 v1(32.37,9.9)
VIN: length 46
  Top Layer w0.254: Q4.1 30.59,12.37 D1.2
  Top Layer w0.635: D1.2 30.59,15.66 R4.2
  Bottom Layer w0.254: 37.55,14.97 38.22,14.97 38.94,14.25 U6.8 40.36,14.25 40.81,13.81 40.81,10.57 41.13,10.25 45.51,10.25 45.67,10.41
  Bottom Layer w0.508: USB1.A9 22.64,8.83 v1(21.54,9.94) ; USB1.A4 27.44,7.67 27.49,7.73 27.49,8.14 27.69,8.34 v1(27.69,9.09) 27.69,9.85 ; U6.4 45.67,10.41 45.67,9.72 46.3,9.1 C4.2 46.27,8.16 46.27,5.54 45.75,5.02 35.41,5.02 31.16,9.27 v1(31.16,11.74)
  vias: v1(20.64,9.94) v1(20.64,9.09) v1(21.54,9.09) v1(27.69,9.94) v1(28.44,9.94) v1(28.44,9.09) v1(31.16,13.33) v1(31.16,12.61)
BLUE: length 167.5
  Top Layer w0.381: Q1.3 7.42,38.99 v1(7.42,40.46) ; LED4.1 5.65,7.51 4.04,7.51 3.28,6.75 3.28,2.7 4.87,1.11 42.7,1.11 44.34,2.75 LED1.1 44.53,4.59 46.07,4.59 47.39,5.92 47.39,10.91 46.11,12.2 38.09,12.2 37.56,12.73 37.56,38.19 38.05,38.68 43.04,38.68 44.34,39.98 LED2.1 46.01,42.4 47.27,43.66 47.27,47.47 46.4,48.35 6.47,48.35 5.74,47.62 LED3.1 v1(4.25,45.6)
  Bottom Layer w0.381: v1(7.42,40.46) 5.75,40.46 4.25,41.96 v1(4.25,45.6)
BLUE_CON: length 18.8
  Top Layer w0.254: v1(6.45,38.01) 6.44,37.99 Q1.1 6.38,36.9 6.38,36.05 6.7,35.72 R29.2
  Bottom Layer w0.254: 16.29,46.6 10.81,46.6 9.63,45.42 9.63,41.18 v1(6.45,38.01)
EN: length 31.8
  Bottom Layer w0.254: R22.1 41.91,32.81 SW1.1 44.46,32.8 46.39,34.74 46.39,39.64 45.59,40.44 36.61,40.44 35.28,41.77 35.28,46.23 34.91,46.6 33.79,46.6
GREEN: length 150.9
  Top Layer w0.381: LED4.5 5.74,3.34 6.08,3 41.34,3 41.92,3.57 41.92,6.61 42.84,7.54 45.12,7.54 45.51,7.92 45.51,10.03 45.12,10.41 36.68,10.41 35.8,11.29 35.8,39.63 36.91,40.74 40.86,40.74 41.24,41.12 41.24,44.89 41.96,45.6 LED2.5 ; LED2.5 44.34,46.16 43.94,46.57 8.9,46.57 8.46,46.13 8.46,43.3 7.57,42.4 LED3.5 ; LED2.5 v1(45.54,45.6) ; v1(47.17,38.95) 46.19,38.95 Q3.3
  Bottom Layer w0.381: v1(47.17,38.95) 47.17,43.97 v1(45.54,45.6)
GREEN_CON: length 14.8
  Top Layer w0.254: v1(45.24,38.06) 45.21,38.04 45.21,35.98 45.4,35.79 R31.2
  Bottom Layer w0.254: v1(45.24,38.06) 40.7,38.06 39.73,39.03 33.84,39.03 33.79,38.98
I2S_BCLK: length 20.9
  Bottom Layer w0.254: U3.25 19.37,31.32 19.37,30.31 18.9,29.84 18.9,22.23 20.33,20.8 20.33,13.33 19.39,12.4 18.64,12.4
I2S_DAT: length 18.8
  Top Layer w0.254: R10.1 R12.2 11.51,27.53 12.06,28.07 v1(12.06,39.02)
  Bottom Layer w0.254: U3.33 13.26,40.26 12.61,39.61 12.59,39.61 12.25,39.26 12.25,39.22 v1(12.06,39.02)
I2S_LRCLK: length 19.5
  Bottom Layer w0.254: 18.26,13.67 19.12,13.67 19.72,14.27 19.72,20.47 18.44,21.75 18.44,29.82 18.05,30.21 18.05,31.39
I2S_SCK: length 17
  Top Layer w0.254: v1(12.84,39.02) 12.84,25.55 R6.1
  Bottom Layer w0.254: U3.32 16.25,39.02 v1(12.84,39.02) ; 16.27,38.96 16.29,38.98
I2S_SDAT: length 23.1
  Bottom Layer w0.254: U3.24 20.59,30.67 19.41,29.48 19.41,22.67 20.95,21.12 20.95,12.81 19.27,11.13 18.26,11.13
I2S_WS: length 16.1
  Top Layer w0.254: R9.1 18.48,27.92 18.11,28.29 15.91,28.29 15.06,29.14 v1(15.06,37.72)
  Bottom Layer w0.254: U3.31 v1(15.06,37.72)
IO0: length 8
  Bottom Layer w0.254: SW2.1 C21.2 16.29,32.8 16.29,32.76
IO1: length 25.1
  Top Layer w0.254: R30.2 2.75,36.82 Q2.1 2.61,37.95
  Bottom Layer w0.254: v1(2.61,38.01) 2.61,45.76 4.73,47.87 16.29,47.87
IO8: length 29.2
  Bottom Layer w0.254: R7.1 R13.2 32.59,14.96 C18.2 32.58,16.13 33.03,16.58 35.57,16.58 36.71,17.71 36.71,34.02 35.57,35.16 33.8,35.16 33.79,35.17
IO9: length 11.2
  Top Layer w0.254: v1(32.71,27.07) 32.76,27.02 R8.1 32.76,23.03 SW3.2
  Bottom Layer w0.254: v1(32.71,27.07) 32.71,28.71 32.21,29.21 29.89,29.21 29.48,29.62 U3.17
IO19: length 38.4
  Bottom Layer w0.254: 24.74,8.75 24.74,8.26 24.79,8.21 USB1.A7 ; 24.74,8.75 24.74,11.73 30.29,17.28 34.97,17.28 36.31,18.62 36.31,33.22 35.63,33.9 33.79,33.9 ; 24.74,8.75 25.45,8.75 25.79,8.41 USB1.B7
IO20: length 38.5
  Bottom Layer w0.254: USB1.A6 25.29,6.57 25.05,6.34 24.48,6.34 24.29,6.52 USB1.B6 24.29,8.21 24.34,8.26 24.34,11.9 30.12,17.69 34.8,17.69 35.9,18.79 35.9,33.06 35.72,33.23 35.4,33.23 34.79,32.63 33.79,32.63
NS_VON: length 3
  Bottom Layer w0.508: 12.83,11.13 11.64,11.13 10.91,10.4 L1.1
NS_VOP: length 2.6
  Bottom Layer w0.508: 12.69,14.92 10.15,14.92 L2.1
RED: length 156.8
  Top Layer w0.381: Q2.3 3.56,42.97 4.59,44 LED3.3 6.76,44 7.4,44.64 7.4,46.58 8.25,47.43 45.87,47.43 46.48,46.82 46.48,44.63 45.85,44 LED2.3 42.64,44 42.12,43.48 42.12,40.45 41.26,39.59 37.51,39.59 36.62,38.7 36.62,12.01 37.22,11.42 45.35,11.42 46.26,10.51 46.26,6.65 45.54,5.93 43.04,5.93 42.74,5.63 42.74,3.05 41.72,2.03 5.58,2.03 4.46,3.15 4.46,5.55 4.9,6 LED4.3
$1N2976: length 2.4
  Bottom Layer w0.254: 23.49,9.74 23.29,9.53 USB1.B5
$1N3072: length 2.4
  Bottom Layer w0.254: USB1.B8 26.79,9.71 26.81,9.73
$1N13153: length 1.9
  Top Layer w0.254: R11.1 16.58,26.51 U4.4
$1N13381: length 4.1
  Top Layer w0.254: R10.2 11.24,23.72 11.78,23.19 14.45,23.19 U4.7
$1N13399: length 2
  Top Layer w0.254: R6.2 13.54,24.03 13.93,24.42 U4.6
$1N13403: length 2.1
  Top Layer w0.254: U4.3 18.09,24.42 R9.2
$1N17103: length 2
  Bottom Layer w0.254: R16.2 18.41,15.08 18.26,14.94
$1N23304: length 1.8
  Bottom Layer w0.254: R2.1 35.95,13.22 35.95,14.98
$1N23309: length 2.3
  Bottom Layer w0.254: U6.7 37.69,12.98 R2.2
$1N23525: length 5.6
  Bottom Layer w0.254: U6.2 46.9,12.98 47.33,13.42 47.33,15.72 46.93,16.12 R3.2
$1N31483: length 4.6
  Bottom Layer w0.508: CN1.2 7.77,13.22 C17.2 10.03,13.52 L2.2
$1N31497: length 4.7
  Bottom Layer w0.508: CN1.1 7.76,11.97 C16.1 9.99,11.68 L1.2
$1N33475: length 1.9
  Top Layer w0.381: 37.84,4.29 39.63,4.29 LED1.2
$1N33478: length 1.9
  Top Layer w0.381: 37.84,7.58 37.86,7.6 LED1.6
$1N33481: length 2
  Top Layer w0.381: LED1.4 37.89,6 R17.1
$1N33489: length 2.6
  Top Layer w0.381: LED3.2 12.9,45.6 R21.1
$1N33492: length 2.6
  Top Layer w0.381: LED3.6 12.89,42.4 R27.1
$1N33495: length 2.6
  Top Layer w0.381: LED3.4 12.9,44 R25.1
$1N33498: length 2.4
  Top Layer w0.381: LED4.6 10.49,4.24 12.49,4.24 12.64,4.4
$1N33506: length 2.4
  Top Layer w0.381: R24.1 12.64,7.6 LED4.2
$1N33509: length 2.3
  Top Layer w0.381: LED4.4 R26.1
$1N33512: length 2.2
  Top Layer w0.381: LED2.6 39.66,45.52 37.59,45.52
$1N33520: length 2.3
  Top Layer w0.381: LED2.2 39.62,42.28 R15.1
$1N33523: length 2.2
  Top Layer w0.381: R18.1 39.62,43.89 LED2.4

## Copper pours and planes (outline as drawn; the poured copper is in the pictures)
GND on Top Layer: -17.39,54.66 55.8,54.66 55.8,-17.73 -17.39,-17.73
GND on Bottom Layer: -4.18,49.96 53.93,49.96 53.93,-3.76 -4.18,-3.76
VIN on Top Layer: 29.89,16.23 31.64,16.23 31.64,11.23 29.89,11.23
VIN on Top Layer: 20.27,10.38 28.76,10.38 28.76,8.71 20.27,8.71
VIN on Bottom Layer: 27.4,13.73 31.57,13.73 31.57,8.58 27.4,8.58
VIN on Bottom Layer: 20.08,10.41 22.44,10.41 22.44,8.54 20.08,8.54

Small or netless copper shapes (teardrops, artwork), in the pictures only: 200 on Top Layer, 198 on Bottom Layer
